# Altium project NCS_Wireless_Control_Card.PrjPcb
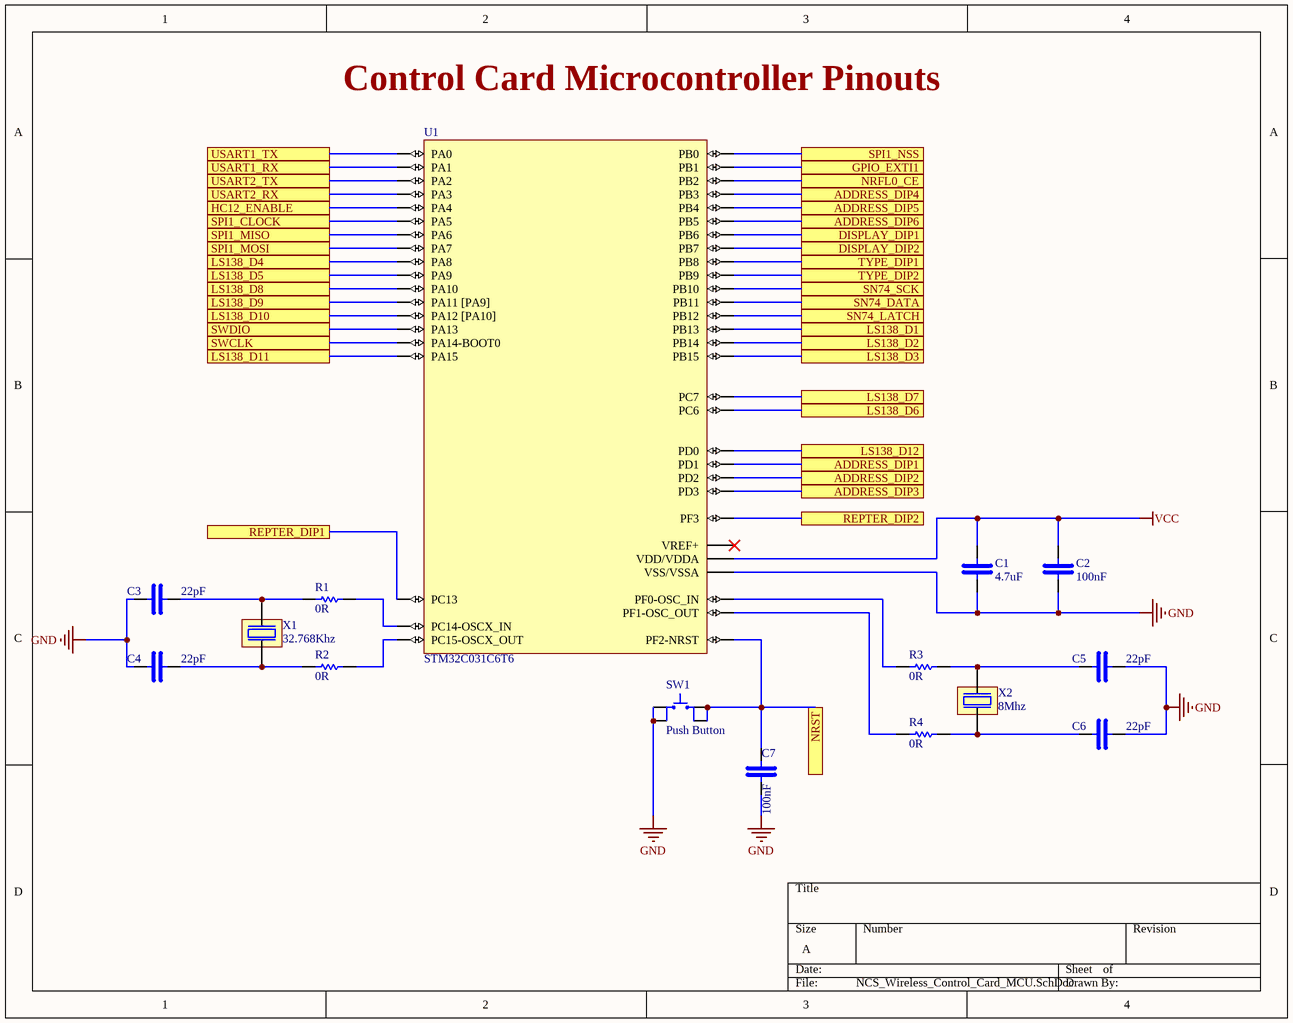
[diagram p0: NCS_Wireless_Control_Card_MCU.SchDoc]
4 sheets, 49 parts. Net scope: flat (ports and power ports of the same name join across sheets).
Board file: NCS_Wireless_Control_Card.PcbDoc
Sheets:
  NCS_Wireless_Control_Card_MCU.SchDoc
  NCS_Wireless_Control_Card_Power_dis_conn.SchDoc
  NCS_Wireless_Control_Card_hc12_display_conn.SchDoc
  NCS_Wireless_Control_Card_Display_Connector.SchDoc

## Sheet NCS_Wireless_Control_Card_MCU.SchDoc
size A

### Parts
C1  4.7uF  [C0805C209D3HACTU_2pF]
C2  100nF  [C0805C104K3RACTU_100nF]
C3  22pF  [C0805C209D3HACTU_2pF]
C4  22pF  [C0805C209D3HACTU_2pF]
C5  22pF  [C0805C209D3HACTU_2pF]
C6  22pF  [C0805C209D3HACTU_2pF]
C7  100nF  [C0805C104K3RACTU_100nF]
R1  0R  [RC0805FR-7W330RL]
R2  0R  [RC0805FR-7W330RL]
R3  0R  [RC0805FR-7W330RL]
R4  0R  [RC0805FR-7W330RL]
SW1  Push Button  [PUSH BUTTON SMD]
U1  STM32C031C6T6  [STM32C031C6T6-48N]
X1  32.768Khz  [32.768KHz]
X2  8Mhz  [8Mhz Crystal]

### Ports
ADDRESS_DIP1, ADDRESS_DIP2, ADDRESS_DIP3, ADDRESS_DIP4, ADDRESS_DIP5, ADDRESS_DIP6, DISPLAY_DIP1, DISPLAY_DIP2, GPIO_EXTI1, HC12_ENABLE, LS138_D1, LS138_D2, LS138_D3, LS138_D4, LS138_D5, LS138_D6, LS138_D7, LS138_D8, LS138_D9, LS138_D10, LS138_D11, LS138_D12, NRFL0_CE, NRST, REPTER_DIP1, REPTER_DIP2, SN74_DATA, SN74_LATCH, SN74_SCK, SPI1_CLOCK, SPI1_MISO, SPI1_MOSI, SPI1_NSS, SWCLK, SWDIO, TYPE_DIP1, TYPE_DIP2, USART1_RX, USART1_TX, USART2_RX, USART2_TX

### Nets
GND: C1.1 C2.1 C3.2 C4.2 C5.1 C6.1 C7.1 SW1.1 SW1.2 U1.7(VSS/VSSA)  [project net BGND]
VCC: C1.2 C2.2 U1.6(VDD/VDDA)
NetC3_1: C3.1 R1.1 X1.2
NetC4_1: C4.1 R2.1 X1.1
NetC5_2: C5.2 R3.2 X2.2
NetC6_2: C6.2 R4.2 X2.1
NetC7_2: C7.2 SW1.3 SW1.4 U1.10(PF2-NRST) ; port NRST
NetDIP1_13: U1.4(PF3) ; port REPTER_DIP2
NetDIP1_14: U1.1(PC13) ; port REPTER_DIP1
NetDIP1_15: U1.48(PB9) ; port TYPE_DIP2
NetDIP1_16: U1.47(PB8) ; port TYPE_DIP1
NetDIP1_17: U1.46(PB7) ; port DISPLAY_DIP2
NetDIP1_18: U1.45(PB6) ; port DISPLAY_DIP1
NetDIP1_19: U1.44(PB5) ; port ADDRESS_DIP6
NetDIP1_20: U1.43(PB4) ; port ADDRESS_DIP5
NetDIP1_21: U1.42(PB3) ; port ADDRESS_DIP4
NetDIP1_22: U1.41(PD3) ; port ADDRESS_DIP3
NetDIP1_23: U1.40(PD2) ; port ADDRESS_DIP2
NetDIP1_24: U1.39(PD1) ; port ADDRESS_DIP1
NetJ1_3: U1.11(PA0) ; port USART1_TX
NetJ1_4: U1.12(PA1) ; port USART1_RX
NetP2_3: U1.21(PB2) ; port NRFL0_CE
NetP2_4: U1.19(PB0) ; port SPI1_NSS
NetP2_5: U1.16(PA5) ; port SPI1_CLOCK
NetP2_6: U1.18(PA7) ; port SPI1_MOSI
NetP2_7: U1.17(PA6) ; port SPI1_MISO
NetP2_8: U1.20(PB1) ; port GPIO_EXTI1
NetP3_3: U1.13(PA2) ; port USART2_TX
NetP3_4: U1.14(PA3) ; port USART2_RX
NetP3_5: U1.15(PA4) ; port HC12_ENABLE
NetP4_3: U1.22(PB10) ; port SN74_SCK
NetP4_4: U1.23(PB11) ; port SN74_DATA
NetP4_5: U1.24(PB12) ; port SN74_LATCH
NetP4_13: U1.38(PD0) ; port LS138_D12
NetP4_14: U1.37(PA15) ; port LS138_D11
NetP4_15: U1.34(PA12_[PA10]) ; port LS138_D10
NetP4_16: U1.33(PA11_[PA9]) ; port LS138_D9
NetP4_17: U1.32(PA10) ; port LS138_D8
NetP4_18: U1.31(PC7) ; port LS138_D7
NetP4_19: U1.30(PC6) ; port LS138_D6
NetP4_20: U1.29(PA9) ; port LS138_D5
NetP4_21: U1.28(PA8) ; port LS138_D4
NetP4_22: U1.27(PB15) ; port LS138_D3
NetP4_23: U1.26(PB14) ; port LS138_D2
NetP4_24: U1.25(PB13) ; port LS138_D1
NetP5_2: U1.35(PA13) ; port SWDIO
NetP5_4: U1.36(PA14-BOOT0) ; port SWCLK
NetR1_2: R1.2 U1.2(PC14-OSCX_IN)
NetR2_2: R2.2 U1.3(PC15-OSCX_OUT)
NetR3_1: R3.1 U1.8(PF0-OSC_IN)
NetR4_1: R4.1 U1.9(PF1-OSC_OUT)

Not connected (* = marked no-connect by the designer): U1 5(VREF+)*

### Notes on the sheet
- Control Card Microcontroller Pinouts

### Library data of the parts
C1 = C0805C475K3PACTU: Multilayer Ceramic Capacitor, 4.7 uF, 25 V, ï¿½ 10%, X5R, 0805 [2012 Metric]; Manufacturer: KEMET; Material: 4241ConductorMaterial; Dissipation Factor: 5%; Voltage Rating (DC): 25V; Supplier: Mouser; Supplier Part Number: 80-C0805C475K3P; Manufacturer Part Number: C0805C475K3PACTU; RoHS: Yes; Category: Ceramic Capacitors; Stock: 222120; Pricing: 1=0.28, 10=0.131, 50=0.131, 100=0.086, 1000=0.071, 10000=0.045 (USD); Mounting Technology: Surface Mount,PCB; Case/Package: 0805; Pins: 2NUMBER; Case Code (Imperial): 0805; Case Code (Metric): 2012; Min Operating Temperature: -55°C; Max Operating Temperature: 85°C; Value: 4.7uF; Tolerance: 10%; Packaging: Tape and Reel; Dielectric: X5R; Termination: SMD/SMT; Package Quantity: 2500; Series: SMD Comm X5R; Construction: Flat; Length: 2mm; Width: 1.2mm; Height: 1.25mm; Depth: 1.25mm; Thickness: 1.397mm; Radiation Hardening: No; Reach SVHC Compliant: No; RoHS Compliant: Yes; ComponentLink1URL: https://datasheet.ciiva.com/22748/1918694-22748309.pdf?src-supplier=Element14; ComponentLink1Description: https://datasheet.ciiva.com/22748/1918694-22748309.pdf?src-supplier=Element14; ComponentLink2URL: https://datasheet.ciiva.com/18193/getdatasheetpartid-195812-18193898.pdf?src-supplier=Verical; ComponentLink2Description: https://datasheet.ciiva.com/18193/getdatasheetpartid-195812-18193898.pdf?src-supplier=Verical; ComponentLink3URL: https://datasheet.ciiva.com/18193/getdatasheetpartid-385757-18193895.pdf?src-supplier=Verical; ComponentLink3Description: https://datasheet.ciiva.com/18193/getdatasheetpartid-385757-18193895.pdf?src-supplier=Verical
C2 C7 = C0805C104K3RACTU: Multilayer Ceramic Capacitor, 0.1 uF, 25 V, ï¿½ 10%, X7R, 0805 [2012 Metric]; Manufacturer: KEMET; Material: 4241ConductorMaterial; Voltage Rating: 25V; Temperature Coefficient: 30ppm/°C; Supplier: Mouser; Supplier Part Number: 80-C0805C104K3R; Manufacturer Part Number: C0805C104K3RACTU; RoHS: Yes; Category: Ceramic Capacitors; Stock: 259681; Pricing: 1=0.1, 10=0.03, 50=0.03, 100=0.027, 1000=0.021, 10000=0.015 (USD); Mounting Technology: Surface Mount,PCB; Case/Package: 0805; Pins: 2NUMBER; Case Code (Imperial): 0805; Case Code (Metric): 2012; Min Operating Temperature: -55°C; Max Operating Temperature: 125°C; Packaging: Tape and Reel; Tolerance: 10%; Value: 100nF; Dielectric: X7R; Termination: SMD/SMT; Package Quantity: 4000; Series: SMD Comm X7R; Voltage Rating (DC): 25V; Construction: Flat; Length: 2mm; Width: 1.2mm; Height: 0.9mm; Depth: 1.25mm; Lead Pitch: 0.75mm; Thickness: 889um; Radiation Hardening: No; RoHS Compliant: Yes; Lead Free: 5697LeadFree; Reach SVHC Compliant: 4186SVHC; ComponentLink1URL: https://datasheet.ciiva.com/7842/kem-c1002-x7r-smd-7842536.pdf?src-supplier=Element14; ComponentLink1Description: https://datasheet.ciiva.com/7842/kem-c1002-x7r-smd-7842536.pdf?src-supplier=Element14; ComponentLink2URL: https://datasheet.ciiva.com/7842/kem-c1002-x7r-smd-7842538.pdf?src-supplier=Element14; ComponentLink2Description: https://datasheet.ciiva.com/7842/kem-c1002-x7r-smd-7842538.pdf?src-supplier=Element14
C3-C6 = C0805C209D3HACTU: C0805C209D3HACTU_2pF; Manufacturer: KEMET; Supplier: Mouser; Supplier Part Number: 80-C0805C209D3HACTU; Manufacturer Part Number: C0805C209D3HACTU; RoHS: Yes; Category: Capacitors; Stock: 22626; Pricing: 1=0.1, 10=0.032, 50=0.032, 100=0.02, 1000=0.015, 10000=0.01 (USD); RoHS Compliant: Yes
R1-R4 = RC0805FR-7W330RL: Res Thick Film 0805 330 Ohm 1% 0.25W(1/4W) ±200ppm/C Pad SMD T/R; Manufacturer: Yageo; Value: 330R; Supplier: Digikey; Supplier Part Number: 13-RC0805FR-7W330RLCT-ND; Manufacturer Part Number: RC0805FR-7W330RL; RoHS: Yes; Category: Chip SMD Resistors; Stock: 5595; Pricing: 1=0.17, 10=0.057, 50=0.046, 100=0.0347, 500=0.03264, 1000=0.0306 (USD); Case/Package: 339Case; Packaging: 10Packaging
SW1 = Tactile Switch SMD 4P 5.2x5.2x1.5mm - EVELTA
U1 = STM32C031C6T6: RISC Microcontroller, 32-Bit, FLASH, CORTEX-M4F CPU, 180MHz, CMOS, PBGA216; Manufacturer: STMicroelectronics; Supplier 1: Mouser; Manufacturer Part Number: STM32C031C6T6; RoHS: No; Category: Microcontrollers; Stock 1: 900; Pricing 1: 1=2.39, 10=1.53, 50=1.36, 100=1.12, 1000=0.78, 10000=0.629 (USD); ComponentLink1URL: https://datasheet.octopart.com/STM32C031C6T6-STMicroelectronics-datasheet-168218616.pdf?src-supplier=TME; ComponentLink1Description: https://datasheet.octopart.com/STM32C031C6T6-STMicroelectronics-datasheet-168218616.pdf?src-supplier=TME; Supplier Part Number 1: 511-STM32C031C6T6
X1 = 32.768 Khz RTC Crystal T38-SUNROM
X2 = 8 Mhz Crystal HC-49US-SUNROM

## Sheet NCS_Wireless_Control_Card_Power_dis_conn.SchDoc
size A
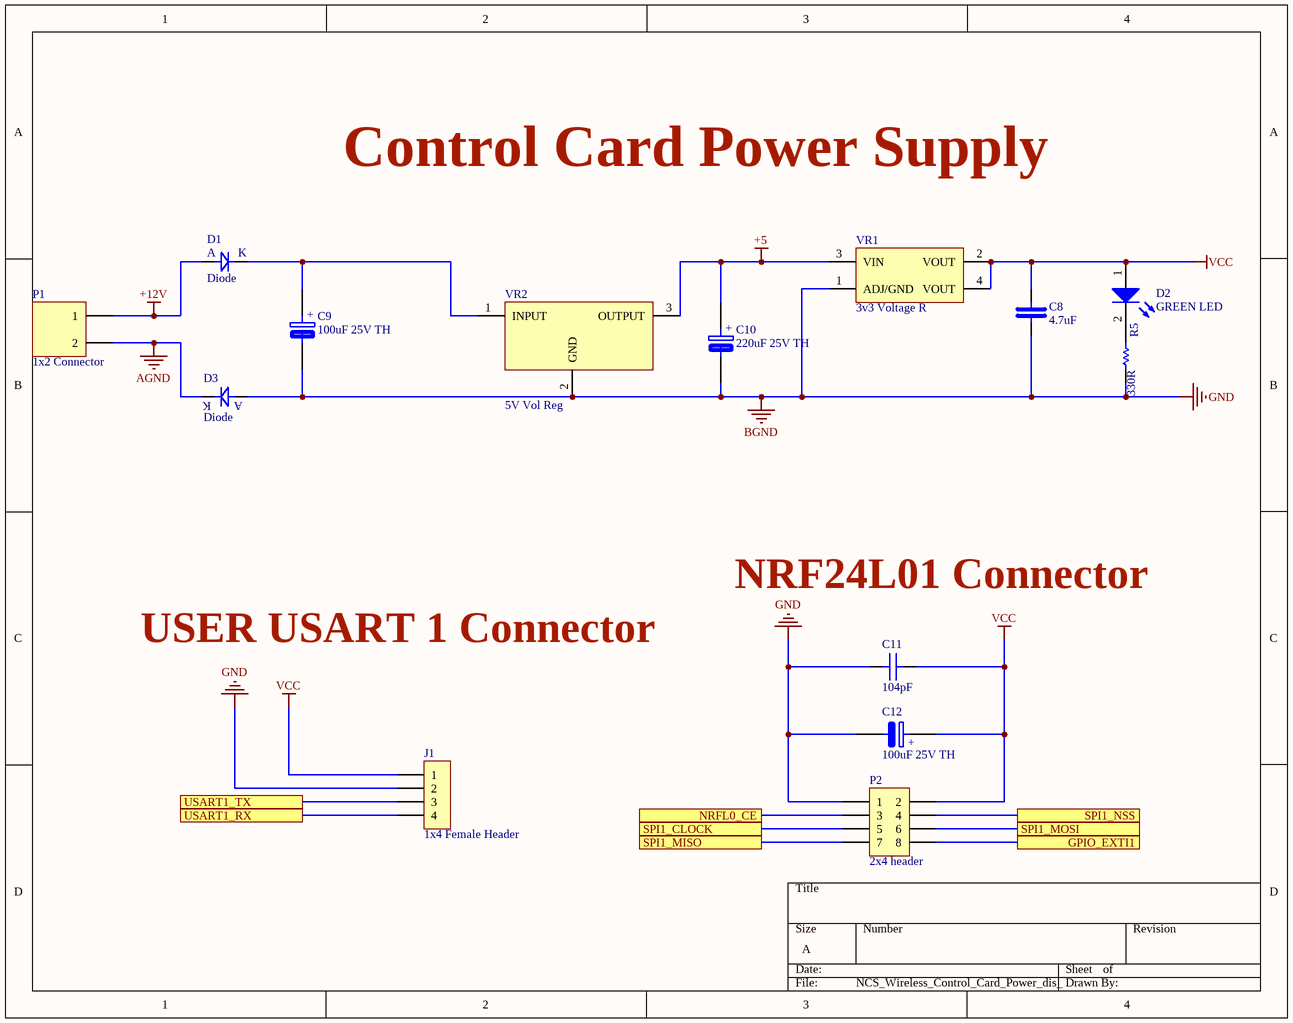
[diagram p1: NCS_Wireless_Control_Card_Power_dis_conn.SchDoc]

### Parts
C8  4.7uF  [C0805C209D3HACTU_2pF]
C9  100uF 25V TH  [100uF 25V TH]
C10  220uF 25V TH  [100uF 25V TH]
C11  104pF  [C0805C471K3RACTU_470pF]
C12  100uF 25V TH  [100uF 25V TH]
D1  Diode  [CRS06(TE85L,Q,M)_DIODE]
D2  GREEN LED  [LTST-C171GKT_GREEN]
D3  Diode  [CRS06(TE85L,Q,M)_DIODE]
J1  1x4 Female Header  [1x4 Female Header]
P1  1x2 Connector  [1x2 Connector]
P2  2x4 header  [2x4 header]
R5  330R  [RC0805FR-7W330RL]
VR1  3v3 Voltage R  [SAMS1117-33-4N]
VR2  5V Vol Reg  [5V Vol Reg DIP]

### Ports
GPIO_EXTI1, NRFL0_CE, SPI1_CLOCK, SPI1_MISO, SPI1_MOSI, SPI1_NSS, USART1_RX, USART1_TX

### Nets
+5: C10.1 VR1.3(VIN) VR2.3(OUTPUT)
+12V: D1.1 P1.1
AGND: D3.2 P1.2
BGND: C8.1 C9.2 C10.2 C11.1 C12.2 D3.1 J1.2 P2.1 R5.1 VR1.1(ADJ/GND) VR2.2(GND)  [also labelled GND]
VCC: C8.2 C11.2 C12.1 D2.1(A) J1.1 P2.2 VR1.2(VOUT) VR1.4(VOUT)
NetC9_1: C9.1 D1.2 VR2.1(INPUT)
NetD2_2: D2.2(K) R5.2
NetJ1_3: J1.3 ; port USART1_TX
NetJ1_4: J1.4 ; port USART1_RX
NetP2_3: P2.3 ; port NRFL0_CE
NetP2_4: P2.4 ; port SPI1_NSS
NetP2_5: P2.5 ; port SPI1_CLOCK
NetP2_6: P2.6 ; port SPI1_MOSI
NetP2_7: P2.7 ; port SPI1_MISO
NetP2_8: P2.8 ; port GPIO_EXTI1

### Notes on the sheet
- Control Card Power Supply
- NRF24L01 Connector
- USER USART 1 Connector
- (in symbol 860010473007) +
- (in symbol CRS06(TE85L,Q,M)) A; K

### Library data of the parts
C8 = C0805C475K3PACTU: as C1 on sheet NCS_Wireless_Control_Card_MCU; Supplier: Mouser; Supplier Part Number: 80-C0805C475K3P; Manufacturer Part Number: C0805C475K3PACTU; RoHS: Yes; Category: Ceramic Capacitors; Stock: 222120; Pricing: 1=0.28, 10=0.131, 50=0.131, 100=0.086, 1000=0.071, 10000=0.045 (USD); Mounting Technology: Surface Mount,PCB; Case/Package: 0805; Pins: 2NUMBER; Case Code (Imperial): 0805; Case Code (Metric): 2012; Min Operating Temperature: -55°C; Max Operating Temperature: 85°C; Value: 4.7uF; Tolerance: 10%; Packaging: Tape and Reel; Dielectric: X5R; Termination: SMD/SMT; Package Quantity: 2500; Series: SMD Comm X5R; Construction: Flat; Length: 2mm; Width: 1.2mm; Height: 1.25mm; Depth: 1.25mm; Thickness: 1.397mm; Radiation Hardening: No; Reach SVHC Compliant: No; RoHS Compliant: Yes; ComponentLink1URL: https://datasheet.ciiva.com/22748/1918694-22748309.pdf?src-supplier=Element14; ComponentLink1Description: https://datasheet.ciiva.com/22748/1918694-22748309.pdf?src-supplier=Element14; ComponentLink2URL: https://datasheet.ciiva.com/18193/getdatasheetpartid-195812-18193898.pdf?src-supplier=Verical; ComponentLink2Description: https://datasheet.ciiva.com/18193/getdatasheetpartid-195812-18193898.pdf?src-supplier=Verical; ComponentLink3URL: https://datasheet.ciiva.com/18193/getdatasheetpartid-385757-18193895.pdf?src-supplier=Verical; ComponentLink3Description: https://datasheet.ciiva.com/18193/getdatasheetpartid-385757-18193895.pdf?src-supplier=Verical
C9 C10 C12 = 860010473007: WCAP-ATG8 Aluminum Electrolytic Capacitors; Manufacturer: Wurth Electronics; Leakage Current: 25uA; Pitch: 2.5mm; Supplier 1: Digikey; Manufacturer Part Number: 860010473007; RoHS: Yes; Category: Aluminum Electrolytic Capacitors; Stock 1: 10593; Pricing 1: 1=0.12, 50=0.1, 100=0.0873, 250=0.07832, 500=0.0675 (USD); Voltage Rating (DC): 25V; Length: 11mm; ComponentLink1URL: https://datasheet.ciiva.com/48693/001280151-da-01-en-wcap-atg8-alu-elec-caps-860010473007-48693591.pdf?src-supplier=Conrad; ComponentLink1Description: https://datasheet.ciiva.com/48693/001280151-da-01-en-wcap-atg8-alu-elec-caps-860010473007-48693591.pdf?src-supplier=Conrad; Supplier Part Number 1: 732-8630-1-ND
C11 = C0805C471K3RACTU: Capacitor, Ceramic, 470pF, 25VDC, 10-% Tol, 10+% Tol, X7R-TC Code, -15, 15%-TC RoHS Compliant: Yes; Manufacturer: KEMET; Supplier: Mouser; Supplier Part Number: 80-C0805C471K3R; Manufacturer Part Number: C0805C471K3RACTU; RoHS: Yes; Category: Ceramic Capacitors; Stock: 4230; Pricing: 1=0.28, 10=0.127, 50=0.127, 100=0.076, 1000=0.064, 10000=0.05 (USD); ComponentLink1URL: http://www.mouser.com/ds/2/212/KEM_C1002_X7R_SMD-1102033.pdf?src-supplier=Mouser; ComponentLink1Description: http://www.mouser.com/ds/2/212/KEM_C1002_X7R_SMD-1102033.pdf?src-supplier=Mouser; ComponentLink2URL: http://components.arrow.com/part/dataview/3447639S9184872N7429?src-supplier=Arrow+Electronics; ComponentLink2Description: http://components.arrow.com/part/dataview/3447639S9184872N7429?src-supplier=Arrow+Electronics; ComponentLink3URL: http://www.kemet.com/docfinder?Partnumber=C0805C471K3RACTU&src-supplier=Digikey; ComponentLink3Description: http://www.kemet.com/docfinder?Partnumber=C0805C471K3RACTU&src-supplier=Digikey
D1 D3 = CRS06(TE85L,Q,M): Diode Schottky 20V 1A 2-Pin S-FLAT T/R / DIODE SCHOTTKY 20V 1A SFLAT; Manufacturer: Toshiba; Supplier: Digikey; Supplier Part Number: CRS06QMCT-ND; Manufacturer Part Number: CRS06(TE85L,Q,M); RoHS: Yes; Category: Rectifier Diodes; Stock: 4733; Pricing: 1=0.41, 10=0.32, 100=0.2283, 500=0.17242, 1000=0.15438 (USD); ComponentLink1URL: https://datasheet.ciiva.com/887/1764-887142.pdf?src-supplier=Digikey; ComponentLink1Description: https://datasheet.ciiva.com/887/1764-887142.pdf?src-supplier=Digikey; ComponentLink2URL: https://datasheet.ciiva.com/26868/getdatasheetpartid-564949-26868437.pdf?src-supplier=Verical; ComponentLink2Description: https://datasheet.ciiva.com/26868/getdatasheetpartid-564949-26868437.pdf?src-supplier=Verical; ComponentLink3URL: https://datasheet.ciiva.com/4715/1638-15026-4715604.pdf?src-supplier=Mouser; ComponentLink3Description: https://datasheet.ciiva.com/4715/1638-15026-4715604.pdf?src-supplier=Mouser; ComponentLink4URL: https://datasheet.ciiva.com/8290/crs06-datasheet-en-20131101-8290709.pdf?src-supplier=Avnet; ComponentLink4Description: https://datasheet.ciiva.com/8290/crs06-datasheet-en-20131101-8290709.pdf?src-supplier=Avnet; ComponentLink5URL: https://datasheet.ciiva.com/916/dst-crs06-tde-en-1638-916705.pdf?src-supplier=Digikey; ComponentLink5Description: https://datasheet.ciiva.com/916/dst-crs06-tde-en-1638-916705.pdf?src-supplier=Digikey
D2 = LTST-C171GKT: LED Low-Power Uni-Color Green 565nm 2.1V 2-Pin Chip LED T/R; Manufacturer: Vishay Lite-On; Lens Color: Colorless; Viewing Angle: 130°; Lens Style: Flat,Diffused,Colorless,Rectangular,Clear; Luminous Intensity: 12mcd; Forward Current: 30mA; Power Rating: 100mW; Dominant Wavelength: 569nm; Test Current: 10mA; Lens Transparency: Clear; Number of Elements: 1; Reverse Voltage: 5V; Lens Size: 1.25mm; Supplier: Digikey; Supplier Part Number: 160-1423-1-ND; Manufacturer Part Number: LTST-C171GKT; RoHS: Yes; Category: LEDs; Stock: 490267; Pricing: 1=0.22, 10=0.121, 100=0.0725, 500=0.0536, 1000=0.04781 (USD); Mounting Technology: Surface Mount; Case/Package: 0805; Pins: 2; Color: Green; Case Code (Metric): 2012; Case Code (Imperial): 0805; Min Operating Temperature: -55°C; Max Operating Temperature: 85°C; Package Quantity: 3000; Packaging: Tape and Reel; Forward Voltage: 2.1V; Illumination Color: Green; Power Dissipation: 100mW; Wavelength: 565nm; Number of LEDs: 1; Series: -; Length: 2mm; Width: 1.25mm; Height: 0.9mm; Depth: 1.25mm; Radiation Hardening: No; Lead Free: Lead Free; RoHS Compliant: Yes; ComponentLink1URL: https://datasheet.ciiva.com/2110/ltst-c171gkt-2110000.pdf?src-supplier=Digikey; ComponentLink1Description: https://datasheet.ciiva.com/2110/ltst-c171gkt-2110000.pdf?src-supplier=Digikey; ComponentLink2URL: https://datasheet.ciiva.com/11773/0900766b80dc0296-11773991.pdf?src-supplier=Rs; ComponentLink2Description: https://datasheet.ciiva.com/11773/0900766b80dc0296-11773991.pdf?src-supplier=Rs; ComponentLink3URL: https://datasheet.ciiva.com/12400/lite-on-ltst-c171gkt-190133-12400647.pdf?src-supplier=Mouser; ComponentLink3Description: https://datasheet.ciiva.com/12400/lite-on-ltst-c171gkt-190133-12400647.pdf?src-supplier=Mouser; ComponentLink4URL: https://datasheet.ciiva.com/2110/ltst-c171gkt-2110001.pdf?src-supplier=Digikey; ComponentLink4Description: https://datasheet.ciiva.com/2110/ltst-c171gkt-2110001.pdf?src-supplier=Digikey; ComponentLink5URL: https://datasheet.ciiva.com/2110/ltst-c171gkt-2110002.pdf?src-supplier=Digikey; ComponentLink5Description: https://datasheet.ciiva.com/2110/ltst-c171gkt-2110002.pdf?src-supplier=Digikey; ComponentLink6URL: https://datasheet.ciiva.com/16396/ltst-c171gkt-16396549.pdf?src-supplier=Future+Electronics; ComponentLink6Description: https://datasheet.ciiva.com/16396/ltst-c171gkt-16396549.pdf?src-supplier=Future+Electronics
J1 = PPPC041LFBN-RC: Female, 4 C, Straight, .100"CC; 3.20mm Tail, No Mounting; PBT, Phos. Bronze, 105 C; Manufacturer: Sullins; Supplier 1: Digikey; Manufacturer Part Number: PPPC041LFBN-RC; RoHS: Yes; Category: Connectors; Stock 1: 15423; Pricing 1: 1=0.42, 10=0.338, 100=0.2755, 500=0.23884, 1000=0.2246, 5000=0.2106 (USD); Contact Material: 150ConductorMaterial; Housing Material: 4239ConductorMaterial; Length: 10.7mm; Width: 2.5mm; Height: 8.5mm; Lead Free: 5697LeadFree; ComponentLink1URL: https://media.digikey.com/pdf/Data%20Sheets/Sullins%20PDFs/Female_Headers.100_DS.pdf?src-supplier=Digikey; ComponentLink1Description: https://media.digikey.com/pdf/Data%20Sheets/Sullins%20PDFs/Female_Headers.100_DS.pdf?src-supplier=Digikey; ComponentLink2URL: http://www.sullinscorp.com/catalogs/78_Page80-81_HEADER_.100_2.54mm_FEMALE.pdf?src-supplier=Future+Electronics; ComponentLink2Description: http://www.sullinscorp.com/catalogs/78_Page80-81_HEADER_.100_2.54mm_FEMALE.pdf?src-supplier=Future+Electronics; ComponentLink3URL: https://datasheet.octopart.com/PPPC041LFBN-RC-Sullins-datasheet-41308905.pdf?src-supplier=Future+Electronics; ComponentLink3Description: https://datasheet.octopart.com/PPPC041LFBN-RC-Sullins-datasheet-41308905.pdf?src-supplier=Future+Electronics; Supplier Part Number 1: S7037-ND
P1 = TB006-508-02BE: 2~24 Poles, Screw Type, Horizontal, 5.08 Pitch, 26~14 (AWG), Terminal Block Connector; Manufacturer: CUI; Supplier: Future Electronics; Supplier Part Number: 9117522; Manufacturer Part Number: TB006-508-02BE; RoHS: Yes
P2 = PPTC042LFBN-RC: Header Connector, Pcb Mnt, 8 Contacts, Skt, 0.1 Pitch, Pc Tail Terminal, Locking; Manufacturer: Sullins; Current Rating: 3A; Number of Contacts: 8NUMBER; Supplier: Digikey; Supplier Part Number: S7072-ND; Manufacturer Part Number: PPTC042LFBN-RC; RoHS: Yes; Category: Headers and Wire Housings; Stock: 8036; Pricing: 1=0.63, 10=0.514, 80=0.427, 440=0.36705, 1000=0.34128, 5000=0.3328 (USD); Contact Material: 150,153,154ConductorMaterial; Housing Material: 4239ConductorMaterial; Length: 10.7mm; Width: 5mm; Height: 8.5mm; Lead Free: 5697LeadFree; ComponentLink1URL: https://media.digikey.com/pdf/Data%20Sheets/Sullins%20PDFs/Female_Headers.100_DS.pdf?src-supplier=Digikey; ComponentLink1Description: https://media.digikey.com/pdf/Data%20Sheets/Sullins%20PDFs/Female_Headers.100_DS.pdf?src-supplier=Digikey; ComponentLink2URL: https://datasheet.octopart.com/PPTC042LFBN-RC-Sullins-datasheet-83216130.pdf?src-supplier=Future+Electronics; ComponentLink2Description: https://datasheet.octopart.com/PPTC042LFBN-RC-Sullins-datasheet-83216130.pdf?src-supplier=Future+Electronics
R5 = RC0805FR-7W330RL: Res Thick Film 0805 330 Ohm 1% 0.25W(1/4W) ±200ppm/C Pad SMD T/R; Manufacturer: Yageo; Supplier: Digikey; Supplier Part Number: 13-RC0805FR-7W330RLCT-ND; Manufacturer Part Number: RC0805FR-7W330RL; RoHS: Yes; Category: Chip SMD Resistors; Stock: 5595; Pricing: 1=0.17, 10=0.057, 50=0.046, 100=0.0347, 500=0.03264, 1000=0.0306 (USD); Case/Package: 339Case; Packaging: 10Packaging; Value: 330R
VR1 = AMS1117-33-3.3V
VR2 = L7805CV: Voltage Regulator; linear; fixed; Vout: 5V; Vin: 7-35V; Vd: 2V; 2%; 1A; 0+150 deg.C; THT; TO220; Manufacturer: STMicroelectronics; Number of Outputs: 1; Polarity: Positive; Max Input Voltage: 35V; Max Output Current: 1.5A; Quiescent Current: 8mA; Min Input Voltage: 7V; Min Output Voltage: 4.65V; Power Supply Rejection Ratio (PSRR): 62dB; Tolerance: 5%; Supplier 1: Mouser; Manufacturer Part Number: L7805CV; RoHS: No; Category: Voltage Regulators - Linear; Stock 1: 45531; Pricing 1: 1=0.5, 10=0.294, 50=0.294, 100=0.255, 1000=0.233, 10000=0.203 (USD); Mount: Through Hole; Case/Package: TO-220; Number of Pins: 3; Contact Plating: Gold; Weight: 2.299997g; Min Operating Temperature: -40°C; Max Operating Temperature: 125°C; Output Voltage: 5V; Output Type: Fixed; Dropout Voltage: 2V; Output Current: 1.5A; Number of Channels: 1; Nominal Output Voltage: 5V; Number of Regulators: 1; Length: 10.4mm; Width: 4.6mm; Height: 9.15mm; Radiation Hardening: No; Lead Free: Lead Free; Reach SVHC Compliant: No; ComponentLink1URL: https://datasheet.ciiva.com/29156/156048-da-01-en-spannungsregler-l-7805-cv-to220-stm-29156924.pdf?src-supplier=Conrad; ComponentLink1Description: https://datasheet.ciiva.com/29156/156048-da-01-en-spannungsregler-l-7805-cv-to220-stm-29156924.pdf?src-supplier=Conrad; ComponentLink2URL: https://datasheet.ciiva.com/6884/1805459-6884463.pdf?src-supplier=Newark; ComponentLink2Description: https://datasheet.ciiva.com/6884/1805459-6884463.pdf?src-supplier=Newark; ComponentLink3URL: https://datasheet.ciiva.com/2073/cd00000444-2073087.pdf?src-supplier=Digikey; ComponentLink3Description: https://datasheet.ciiva.com/2073/cd00000444-2073087.pdf?src-supplier=Digikey; ComponentLink4URL: https://datasheet.ciiva.com/16458/cd00000444-16458159.pdf?src-supplier=Future+Electronics; ComponentLink4Description: https://datasheet.ciiva.com/16458/cd00000444-16458159.pdf?src-supplier=Future+Electronics; Supplier Part Number 1: 511-L7805CV

## Sheet NCS_Wireless_Control_Card_hc12_display_conn.SchDoc
size A
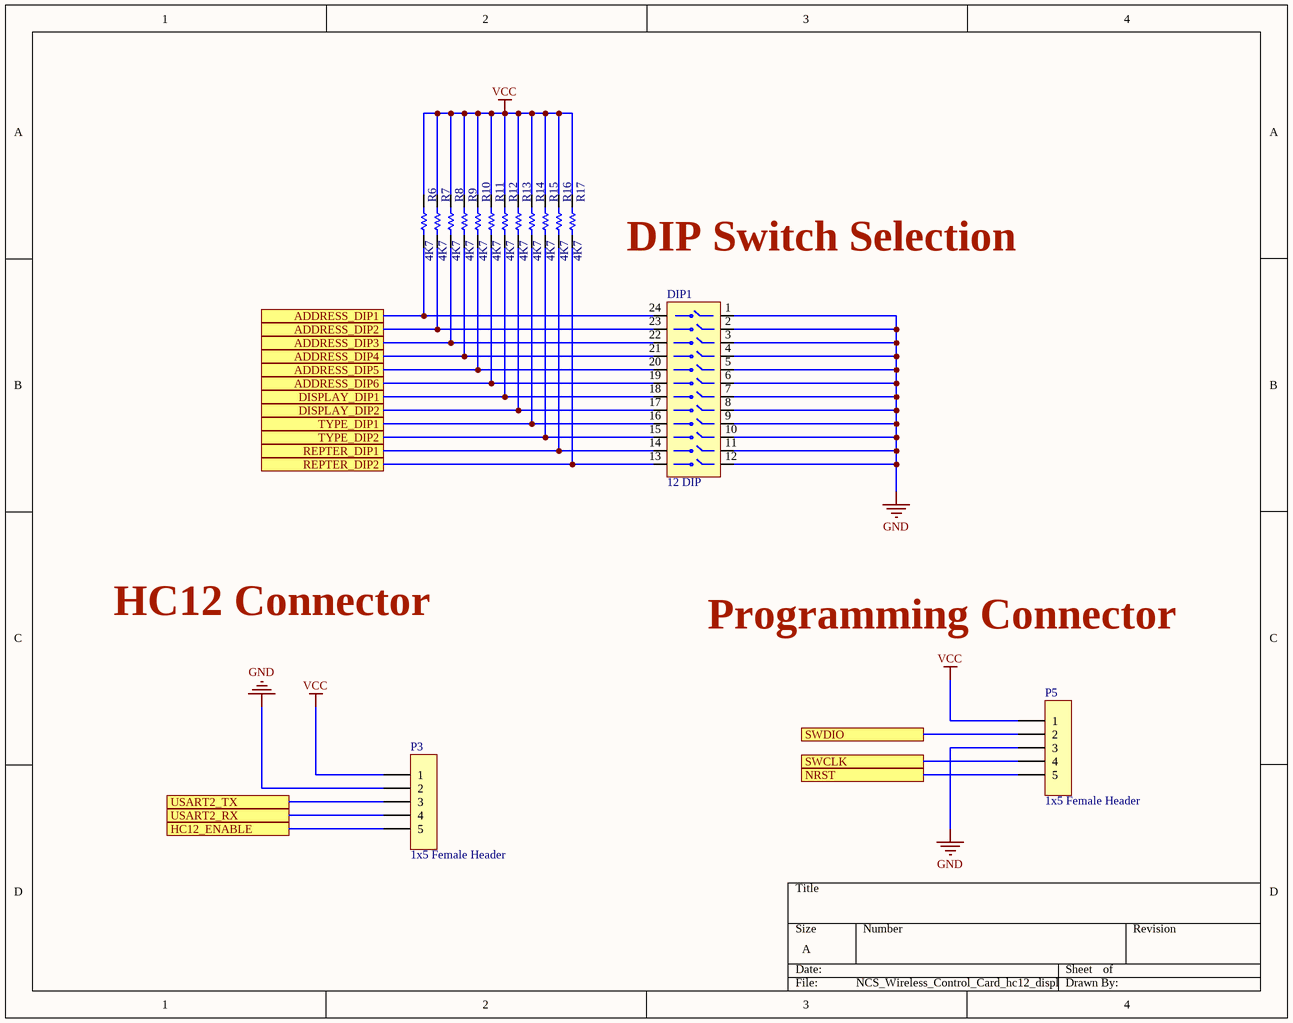
[diagram p2: NCS_Wireless_Control_Card_hc12_display_conn.SchDoc]

### Parts
DIP1  12 DIP  [DIP24]
P3  1x5 Female Header  [1x5 Female Header]
P5  1x5 Female Header  [1x5 Female Header]
R6  4K7  [RC0805FR-7W330RL]
R7  4K7  [RC0805FR-7W330RL]
R8  4K7  [RC0805FR-7W330RL]
R9  4K7  [RC0805FR-7W330RL]
R10  4K7  [RC0805FR-7W330RL]
R11  4K7  [RC0805FR-7W330RL]
R12  4K7  [RC0805FR-7W330RL]
R13  4K7  [RC0805FR-7W330RL]
R14  4K7  [RC0805FR-7W330RL]
R15  4K7  [RC0805FR-7W330RL]
R16  4K7  [RC0805FR-7W330RL]
R17  4K7  [RC0805FR-7W330RL]

### Ports
ADDRESS_DIP1, ADDRESS_DIP2, ADDRESS_DIP3, ADDRESS_DIP4, ADDRESS_DIP5, ADDRESS_DIP6, DISPLAY_DIP1, DISPLAY_DIP2, HC12_ENABLE, NRST, REPTER_DIP1, REPTER_DIP2, SWCLK, SWDIO, TYPE_DIP1, TYPE_DIP2, USART2_RX, USART2_TX

### Nets
GND: DIP1.1 DIP1.2 DIP1.3 DIP1.4 DIP1.5 DIP1.6 DIP1.7 DIP1.8 DIP1.9 DIP1.10 DIP1.11 DIP1.12 P3.2 P5.3  [project net BGND]
VCC: P3.1 P5.1 R6.2 R7.2 R8.2 R9.2 R10.2 R11.2 R12.2 R13.2 R14.2 R15.2 R16.2 R17.2
NetC7_2: P5.5 ; port NRST
NetDIP1_13: DIP1.13 R17.1 ; port REPTER_DIP2
NetDIP1_14: DIP1.14 R16.1 ; port REPTER_DIP1
NetDIP1_15: DIP1.15 R15.1 ; port TYPE_DIP2
NetDIP1_16: DIP1.16 R14.1 ; port TYPE_DIP1
NetDIP1_17: DIP1.17 R13.1 ; port DISPLAY_DIP2
NetDIP1_18: DIP1.18 R12.1 ; port DISPLAY_DIP1
NetDIP1_19: DIP1.19 R11.1 ; port ADDRESS_DIP6
NetDIP1_20: DIP1.20 R10.1 ; port ADDRESS_DIP5
NetDIP1_21: DIP1.21 R9.1 ; port ADDRESS_DIP4
NetDIP1_22: DIP1.22 R8.1 ; port ADDRESS_DIP3
NetDIP1_23: DIP1.23 R7.1 ; port ADDRESS_DIP2
NetDIP1_24: DIP1.24 R6.1 ; port ADDRESS_DIP1
NetP3_3: P3.3 ; port USART2_TX
NetP3_4: P3.4 ; port USART2_RX
NetP3_5: P3.5 ; port HC12_ENABLE
NetP5_2: P5.2 ; port SWDIO
NetP5_4: P5.4 ; port SWCLK

### Notes on the sheet
- DIP Switch Selection
- HC12 Connector
- Programming Connector

### Library data of the parts
DIP1 = 12 Way 2.54MM DIP switch - SUNROM
P3 P5 = M20-9990546: 2.54mm (0.1) Pitch SIL Vertical PC Tail Pin Header, 6.1mm mating pin height, tin, 5 contacts"; Manufacturer: Harwin; Number of Contacts: 5; Current Rating: 3A; Gender: Male; Insulation Resistance: 10GR; Voltage Rating (DC): 750V; Mated Stacking Heights: 16.54mm; Supplier: Digikey; Supplier Part Number: 952-2268-ND; Manufacturer Part Number: M20-9990546; RoHS: Yes; Category: Headers and Wire Housings; Stock: 16218; Pricing: 1=0.2, 10=0.163, 100=0.1329, 500=0.11516, 1000=0.10828, 5000=0.09388, 10000=0.08828 (USD); Mounting Technology: Through Hole; Case/Package: SIL; Contact Material: Brass,Bronze; Contact Plating: Tin; Contact Shape: Square; Contact Finish - Mating: TIN; Insulation Material: Nylon; Insulation Color: Black; Min Operating Temperature: -40°C; Max Operating Temperature: 105°C; Number of Rows: 1; Termination: Solder; Package Quantity: 1000; Packaging: Bulk; Number of Positions: 5; Orientation: Straight; Series: M20; Contact Type: Male Pin; Fastening Type: Pull; Pitch: 2.54mm; Reach SVHC Compliant: No; RoHS Compliant: Yes; Flammability Rating: UL94 V-0; ComponentLink1URL: https://datasheet.ciiva.com/11749/0900766b80da602d-11749062.pdf?src-supplier=Rs; ComponentLink1Description: https://datasheet.ciiva.com/11749/0900766b80da602d-11749062.pdf?src-supplier=Rs; ComponentLink2URL: https://datasheet.ciiva.com/6833/m20-999-6833320.pdf?src-supplier=Digikey; ComponentLink2Description: https://datasheet.ciiva.com/6833/m20-999-6833320.pdf?src-supplier=Digikey; ComponentLink3URL: https://datasheet.ciiva.com/8046/315376-8046940.pdf?src-supplier=Element14; ComponentLink3Description: https://datasheet.ciiva.com/8046/315376-8046940.pdf?src-supplier=Element14
R6-R17 = RC0805FR-7W330RL: as R1 on sheet NCS_Wireless_Control_Card_MCU; Supplier: Digikey; Supplier Part Number: 13-RC0805FR-7W330RLCT-ND; Manufacturer Part Number: RC0805FR-7W330RL; RoHS: Yes; Category: Chip SMD Resistors; Stock: 5595; Pricing: 1=0.17, 10=0.057, 50=0.046, 100=0.0347, 500=0.03264, 1000=0.0306 (USD); Case/Package: 339Case; Packaging: 10Packaging

## Sheet NCS_Wireless_Control_Card_Display_Connector.SchDoc
size A
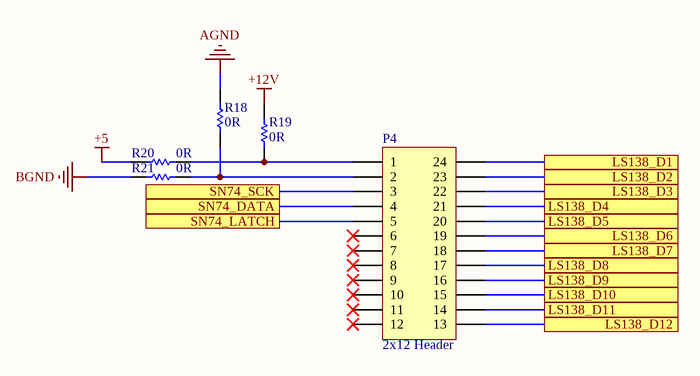
[diagram p3: NCS_Wireless_Control_Card_Display_Connector.SchDoc]

### Parts
P4  2x12 Header  [2x12 header]
R18  0R  [RC0805FR-7W330RL]
R19  0R  [RC0805FR-7W330RL]
R20  0R  [RC0805FR-7W330RL]
R21  0R  [RC0805FR-7W330RL]

### Ports
LS138_D1, LS138_D2, LS138_D3, LS138_D4, LS138_D5, LS138_D6, LS138_D7, LS138_D8, LS138_D9, LS138_D10, LS138_D11, LS138_D12, SN74_DATA, SN74_LATCH, SN74_SCK

### Nets
+5: R20.2
+12V: R19.2
AGND: R18.2
BGND: R21.2
NetP4_1: P4.1 R19.1 R20.1
NetP4_2: P4.2 R18.1 R21.1
NetP4_3: P4.3 ; port SN74_SCK
NetP4_4: P4.4 ; port SN74_DATA
NetP4_5: P4.5 ; port SN74_LATCH
NetP4_13: P4.13 ; port LS138_D12
NetP4_14: P4.14 ; port LS138_D11
NetP4_15: P4.15 ; port LS138_D10
NetP4_16: P4.16 ; port LS138_D9
NetP4_17: P4.17 ; port LS138_D8
NetP4_18: P4.18 ; port LS138_D7
NetP4_19: P4.19 ; port LS138_D6
NetP4_20: P4.20 ; port LS138_D5
NetP4_21: P4.21 ; port LS138_D4
NetP4_22: P4.22 ; port LS138_D3
NetP4_23: P4.23 ; port LS138_D2
NetP4_24: P4.24 ; port LS138_D1

Not connected (* = marked no-connect by the designer): P4 6* 7* 8* 9* 10* 11* 12*

### Library data of the parts
P4 = 0702462401: 2.54mm Pitch C-Grid Header Low Profile Dual Row Vertical Shrouded 24 Circuits 0.38; Manufacturer: Molex; Supplier: Mouser; Supplier Part Number: 538-70246-2401; Manufacturer Part Number: 0702462401; RoHS: Yes; Stock: 1024; Pricing: 1=2.2, 10=1.67, 50=1.67, 100=1.31, 1000=1.31, 10000=1.29 (USD); ComponentLink1URL: https://datasheet.ciiva.com/9470/0702462401-pcb-headers-9470294.pdf?src-supplier=Avnet; ComponentLink1Description: https://datasheet.ciiva.com/9470/0702462401-pcb-headers-9470294.pdf?src-supplier=Avnet
R18-R21 = RC0805FR-7W330RL: as R1 on sheet NCS_Wireless_Control_Card_MCU; Supplier: Digikey; Supplier Part Number: 13-RC0805FR-7W330RLCT-ND; Manufacturer Part Number: RC0805FR-7W330RL; RoHS: Yes; Category: Chip SMD Resistors; Stock: 5595; Pricing: 1=0.17, 10=0.057, 50=0.046, 100=0.0347, 500=0.03264, 1000=0.0306 (USD); Case/Package: 339Case; Packaging: 10Packaging

## Nets that join several sheets
+5: NCS_Wireless_Control_Card_Power_dis_conn (C10.1 VR1.3 VR2.3), NCS_Wireless_Control_Card_Display_Connector (R20.2)
+12V: NCS_Wireless_Control_Card_Power_dis_conn (D1.1 P1.1), NCS_Wireless_Control_Card_Display_Connector (R19.2)
AGND: NCS_Wireless_Control_Card_Power_dis_conn (D3.2 P1.2), NCS_Wireless_Control_Card_Display_Connector (R18.2)
BGND: NCS_Wireless_Control_Card_MCU (10 pins), NCS_Wireless_Control_Card_Power_dis_conn (11 pins), NCS_Wireless_Control_Card_hc12_display_conn (14 pins), NCS_Wireless_Control_Card_Display_Connector (R21.2)
VCC: NCS_Wireless_Control_Card_MCU (C1.2 C2.2 U1.6), NCS_Wireless_Control_Card_Power_dis_conn (8 pins), NCS_Wireless_Control_Card_hc12_display_conn (14 pins)
NetC7_2: NCS_Wireless_Control_Card_MCU (C7.2 SW1.3 SW1.4 U1.10), NCS_Wireless_Control_Card_hc12_display_conn (P5.5)
NetDIP1_13: NCS_Wireless_Control_Card_MCU (U1.4), NCS_Wireless_Control_Card_hc12_display_conn (DIP1.13 R17.1)
NetDIP1_14: NCS_Wireless_Control_Card_MCU (U1.1), NCS_Wireless_Control_Card_hc12_display_conn (DIP1.14 R16.1)
NetDIP1_15: NCS_Wireless_Control_Card_MCU (U1.48), NCS_Wireless_Control_Card_hc12_display_conn (DIP1.15 R15.1)
NetDIP1_16: NCS_Wireless_Control_Card_MCU (U1.47), NCS_Wireless_Control_Card_hc12_display_conn (DIP1.16 R14.1)
NetDIP1_17: NCS_Wireless_Control_Card_MCU (U1.46), NCS_Wireless_Control_Card_hc12_display_conn (DIP1.17 R13.1)
NetDIP1_18: NCS_Wireless_Control_Card_MCU (U1.45), NCS_Wireless_Control_Card_hc12_display_conn (DIP1.18 R12.1)
NetDIP1_19: NCS_Wireless_Control_Card_MCU (U1.44), NCS_Wireless_Control_Card_hc12_display_conn (DIP1.19 R11.1)
NetDIP1_20: NCS_Wireless_Control_Card_MCU (U1.43), NCS_Wireless_Control_Card_hc12_display_conn (DIP1.20 R10.1)
NetDIP1_21: NCS_Wireless_Control_Card_MCU (U1.42), NCS_Wireless_Control_Card_hc12_display_conn (DIP1.21 R9.1)
NetDIP1_22: NCS_Wireless_Control_Card_MCU (U1.41), NCS_Wireless_Control_Card_hc12_display_conn (DIP1.22 R8.1)
NetDIP1_23: NCS_Wireless_Control_Card_MCU (U1.40), NCS_Wireless_Control_Card_hc12_display_conn (DIP1.23 R7.1)
NetDIP1_24: NCS_Wireless_Control_Card_MCU (U1.39), NCS_Wireless_Control_Card_hc12_display_conn (DIP1.24 R6.1)
NetJ1_3: NCS_Wireless_Control_Card_MCU (U1.11), NCS_Wireless_Control_Card_Power_dis_conn (J1.3)
NetJ1_4: NCS_Wireless_Control_Card_MCU (U1.12), NCS_Wireless_Control_Card_Power_dis_conn (J1.4)
NetP2_3: NCS_Wireless_Control_Card_MCU (U1.21), NCS_Wireless_Control_Card_Power_dis_conn (P2.3)
NetP2_4: NCS_Wireless_Control_Card_MCU (U1.19), NCS_Wireless_Control_Card_Power_dis_conn (P2.4)
NetP2_5: NCS_Wireless_Control_Card_MCU (U1.16), NCS_Wireless_Control_Card_Power_dis_conn (P2.5)
NetP2_6: NCS_Wireless_Control_Card_MCU (U1.18), NCS_Wireless_Control_Card_Power_dis_conn (P2.6)
NetP2_7: NCS_Wireless_Control_Card_MCU (U1.17), NCS_Wireless_Control_Card_Power_dis_conn (P2.7)
NetP2_8: NCS_Wireless_Control_Card_MCU (U1.20), NCS_Wireless_Control_Card_Power_dis_conn (P2.8)
NetP3_3: NCS_Wireless_Control_Card_MCU (U1.13), NCS_Wireless_Control_Card_hc12_display_conn (P3.3)
NetP3_4: NCS_Wireless_Control_Card_MCU (U1.14), NCS_Wireless_Control_Card_hc12_display_conn (P3.4)
NetP3_5: NCS_Wireless_Control_Card_MCU (U1.15), NCS_Wireless_Control_Card_hc12_display_conn (P3.5)
NetP4_3: NCS_Wireless_Control_Card_MCU (U1.22), NCS_Wireless_Control_Card_Display_Connector (P4.3)
NetP4_4: NCS_Wireless_Control_Card_MCU (U1.23), NCS_Wireless_Control_Card_Display_Connector (P4.4)
NetP4_5: NCS_Wireless_Control_Card_MCU (U1.24), NCS_Wireless_Control_Card_Display_Connector (P4.5)
NetP4_13: NCS_Wireless_Control_Card_MCU (U1.38), NCS_Wireless_Control_Card_Display_Connector (P4.13)
NetP4_14: NCS_Wireless_Control_Card_MCU (U1.37), NCS_Wireless_Control_Card_Display_Connector (P4.14)
NetP4_15: NCS_Wireless_Control_Card_MCU (U1.34), NCS_Wireless_Control_Card_Display_Connector (P4.15)
NetP4_16: NCS_Wireless_Control_Card_MCU (U1.33), NCS_Wireless_Control_Card_Display_Connector (P4.16)
NetP4_17: NCS_Wireless_Control_Card_MCU (U1.32), NCS_Wireless_Control_Card_Display_Connector (P4.17)
NetP4_18: NCS_Wireless_Control_Card_MCU (U1.31), NCS_Wireless_Control_Card_Display_Connector (P4.18)
NetP4_19: NCS_Wireless_Control_Card_MCU (U1.30), NCS_Wireless_Control_Card_Display_Connector (P4.19)
NetP4_20: NCS_Wireless_Control_Card_MCU (U1.29), NCS_Wireless_Control_Card_Display_Connector (P4.20)
NetP4_21: NCS_Wireless_Control_Card_MCU (U1.28), NCS_Wireless_Control_Card_Display_Connector (P4.21)
NetP4_22: NCS_Wireless_Control_Card_MCU (U1.27), NCS_Wireless_Control_Card_Display_Connector (P4.22)
NetP4_23: NCS_Wireless_Control_Card_MCU (U1.26), NCS_Wireless_Control_Card_Display_Connector (P4.23)
NetP4_24: NCS_Wireless_Control_Card_MCU (U1.25), NCS_Wireless_Control_Card_Display_Connector (P4.24)
NetP5_2: NCS_Wireless_Control_Card_MCU (U1.35), NCS_Wireless_Control_Card_hc12_display_conn (P5.2)
NetP5_4: NCS_Wireless_Control_Card_MCU (U1.36), NCS_Wireless_Control_Card_hc12_display_conn (P5.4)